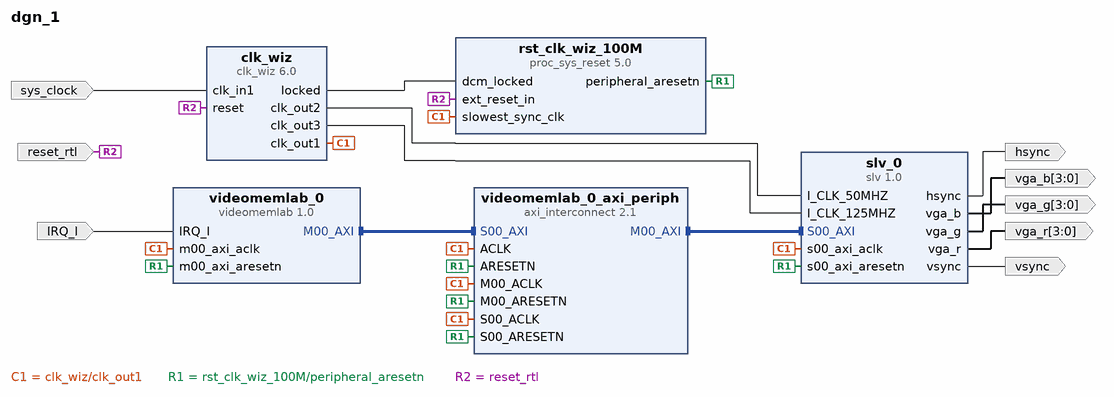
[diagram p0: block diagram of the top level]
# Vivado block design dgn_1, xc7z010clg400-1, Vivado 2019.2
create_bd_design dgn_1

create_bd_port -dir I -type clk sys_clock
set_property -dict {CONFIG.FREQ_HZ 125000000 CONFIG.PHASE 0.000} [get_bd_ports sys_clock]
create_bd_port -dir I -type rst reset_rtl
set_property -dict {CONFIG.POLARITY ACTIVE_HIGH} [get_bd_ports reset_rtl]
create_bd_port -dir I IRQ_I
create_bd_port -dir O hsync
create_bd_port -dir O vsync
create_bd_port -dir O -from 3 -to 0 vga_r
create_bd_port -dir O -from 3 -to 0 vga_g
create_bd_port -dir O -from 3 -to 0 vga_b

create_bd_cell -type ip -vlnv xilinx.com:ip:axi_interconnect:2.1 videomemlab_0_axi_periph
set_property -dict {CONFIG.NUM_MI 1} [get_bd_cells videomemlab_0_axi_periph]
create_bd_cell -type ip -vlnv xilinx.com:ip:clk_wiz:6.0 clk_wiz
set_property -dict [list \
  CONFIG.CLKOUT2_JITTER 143.688 \
  CONFIG.CLKOUT2_PHASE_ERROR 96.948 \
  CONFIG.CLKOUT2_REQUESTED_OUT_FREQ 50.000 \
  CONFIG.CLKOUT2_USED true \
  CONFIG.CLKOUT3_JITTER 119.348 \
  CONFIG.CLKOUT3_PHASE_ERROR 96.948 \
  CONFIG.CLKOUT3_REQUESTED_OUT_FREQ 125.000 \
  CONFIG.CLKOUT3_USED true \
  CONFIG.CLK_IN1_BOARD_INTERFACE sys_clock \
  CONFIG.MMCM_CLKOUT1_DIVIDE 20 \
  CONFIG.MMCM_CLKOUT2_DIVIDE 8 \
  CONFIG.NUM_OUT_CLKS 3 \
  CONFIG.USE_BOARD_FLOW true \
] [get_bd_cells clk_wiz]
create_bd_cell -type ip -vlnv xilinx.com:ip:proc_sys_reset:5.0 rst_clk_wiz_100M
create_bd_cell -type ip -vlnv clarkson.edu:user:videomemlab:1.0 videomemlab_0
create_bd_cell -type ip -vlnv clarkson.edu:user:slv:1.0 slv_0

# ---- connections ----

connect_bd_intf_net [get_bd_intf_pins videomemlab_0_axi_periph/M00_AXI] [get_bd_intf_pins slv_0/S00_AXI]
connect_bd_intf_net [get_bd_intf_pins videomemlab_0/M00_AXI] [get_bd_intf_pins videomemlab_0_axi_periph/S00_AXI]
connect_bd_net [get_bd_pins clk_wiz/clk_out1] \
  [get_bd_pins videomemlab_0_axi_periph/S00_ACLK] [get_bd_pins rst_clk_wiz_100M/slowest_sync_clk] \
  [get_bd_pins videomemlab_0_axi_periph/M00_ACLK] [get_bd_pins videomemlab_0_axi_periph/ACLK] \
  [get_bd_pins videomemlab_0/m00_axi_aclk] [get_bd_pins slv_0/s00_axi_aclk]
connect_bd_net [get_bd_pins clk_wiz/locked] [get_bd_pins rst_clk_wiz_100M/dcm_locked]
connect_bd_net [get_bd_pins rst_clk_wiz_100M/peripheral_aresetn] \
  [get_bd_pins videomemlab_0_axi_periph/S00_ARESETN] [get_bd_pins videomemlab_0_axi_periph/M00_ARESETN] \
  [get_bd_pins videomemlab_0_axi_periph/ARESETN] [get_bd_pins videomemlab_0/m00_axi_aresetn] \
  [get_bd_pins slv_0/s00_axi_aresetn]
connect_bd_net [get_bd_ports sys_clock] [get_bd_pins clk_wiz/clk_in1]
connect_bd_net [get_bd_ports reset_rtl] [get_bd_pins clk_wiz/reset] [get_bd_pins rst_clk_wiz_100M/ext_reset_in]
connect_bd_net [get_bd_pins clk_wiz/clk_out2] [get_bd_pins slv_0/I_CLK_50MHZ]
connect_bd_net [get_bd_pins clk_wiz/clk_out3] [get_bd_pins slv_0/I_CLK_125MHZ]
connect_bd_net [get_bd_pins slv_0/hsync] [get_bd_ports hsync]
connect_bd_net [get_bd_pins slv_0/vga_g] [get_bd_ports vga_g]
connect_bd_net [get_bd_pins slv_0/vga_b] [get_bd_ports vga_b]
connect_bd_net [get_bd_pins slv_0/vsync] [get_bd_ports vsync]
connect_bd_net [get_bd_pins slv_0/vga_r] [get_bd_ports vga_r]
connect_bd_net [get_bd_ports IRQ_I] [get_bd_pins videomemlab_0/IRQ_I]

# ---- address map ----
assign_bd_address -offset 0x44A00000 -range 64K -target_address_space [get_bd_addr_spaces videomemlab_0/M00_AXI] [get_bd_addr_segs slv_0/S00_AXI/S00_AXI_reg]

validate_bd_design
save_bd_design
